# Altium schematic sheet ATmega324PB_Xplained_Pro_EDBG.SchDoc: Embedded Debugger (EDBG)
size A3; Organization: ATMEL Norway; Address1: Vestre Rosten 79; Address2: N-7075 TILLER; Address3: NORWAY; DocumentNumber: A09-2589; Revision: 1; SheetNumber: 5; SheetTotal: 5; PageSetup: Record=PageOptions|CenterHorizontal=True|CenterVertical=True|PrintScale=0.73|XCorrection=1.00|YCorrection=1.00|PrintKind=1|BorderSize=5000000|LeftOffset=0|BottomOffset=0|Orientation=2|PaperLength=1000|PaperWidth=1000|Scale=100|PaperSource=7|PrintQuality=-4|MediaType=1|DitherType=10|PaperKind=A3 (297 x 420 mm)|PrintScaleMode=1
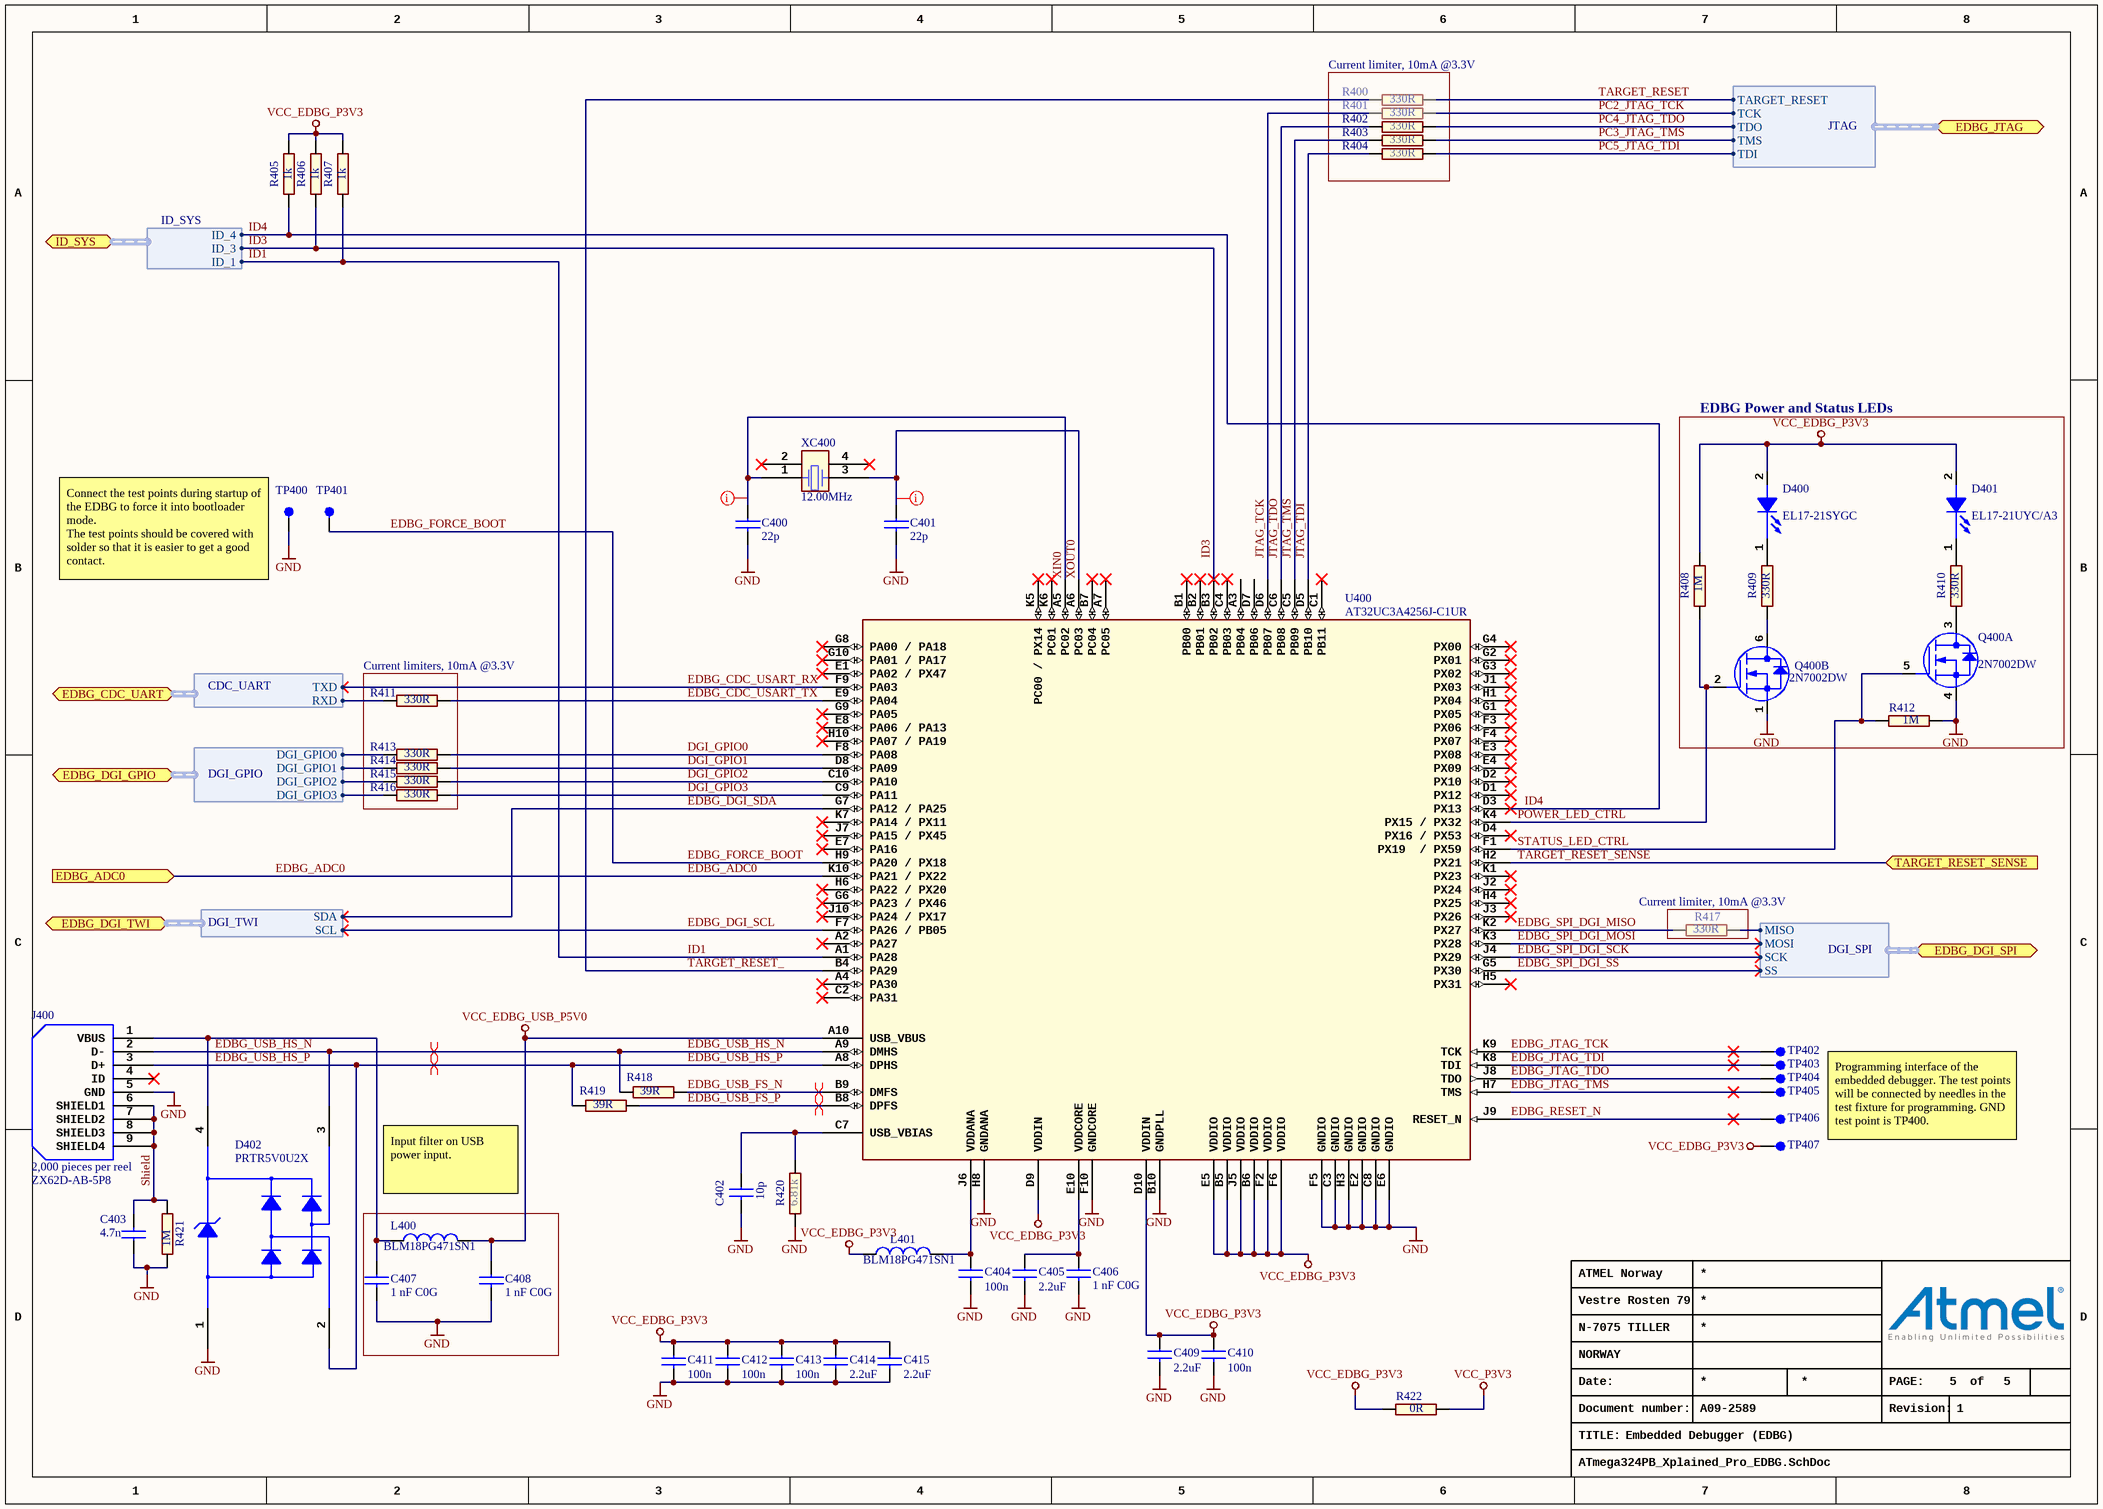
[diagram p0: ATmega324PB_Xplained_Pro_EDBG.SchDoc]

## Parts
C400  value 22p  [AP1-00053]
C401  value 22p  [AP1-00053]
C402  value 10p  [AP1-00053]
C403  value 4.7n  [AP1-00053]
C404  value 100n  [AP1-00053]
C405  value 2.2uF  [AP1-00053]  (hidden comment: Farnell no: 1288200)
C406  value 1 nF C0G  [AP1-00053]
C407  value 1 nF C0G  [AP1-00053]
C408  value 1 nF C0G  [AP1-00053]
C409  value 2.2uF  [AP1-00053]  (hidden comment: Farnell no: 1288200)
C410  value 100n  [AP1-00053]
C411  value 100n  [AP1-00053]
C412  value 100n  [AP1-00053]
C413  value 100n  [AP1-00053]
C414  value 2.2uF  [AP1-00053]  (hidden comment: Farnell no: 1288200)
C415  value 2.2uF  [AP1-00053]  (hidden comment: Farnell no: 1288200)
D400  value EL17-21SYGC  [AP4-00013]
D401  value EL17-21UYC/A3  [AP4-00013]
D402  value PRTR5V0U2X  [AP4-00001]  (hidden comment: Changed manufacturer from Philips to NXP.)
J400  2,000 pieces per reel  value ZX62D-AB-5P8  [AP8-00852]
L400  value BLM18PG471SN1  [AP3-00005]
L401  value BLM18PG471SN1  [AP3-00005]
Q400  value 2N7002DW  [AP5-00001]  (hidden comment: Same as 2N7002 but with two MOSFETs in one package)  (parts A,B of 2)
R400  value 330R  [AP2-00000]
R401  value 330R  [AP2-00000]
R402  value 330R  [AP2-00000]
R403  value 330R  [AP2-00000]
R404  value 330R  [AP2-00000]
R405  value 1k  [AP2-00000]
R406  value 1k  [AP2-00000]
R407  value 1k  [AP2-00000]
R408  value 1M  [AP2-00000]
R409  value 330R  [AP2-00000]
R410  value 330R  [AP2-00000]
R411  value 330R  [AP2-00000]
R412  value 1M  [AP2-00000]
R413  value 330R  [AP2-00000]
R414  value 330R  [AP2-00000]
R415  value 330R  [AP2-00000]
R416  value 330R  [AP2-00000]
R417  value 330R  [AP2-00000]
R418  value 39R  [AP2-00011]
R419  value 39R  [AP2-00011]
R420  value 6.81k  [AP2-00011]
R421  value 1M  [AP2-00011]
R422  value 0R  [AP2-00000]
TP400  (no value)  [AP8-00010]  (no BOM)
TP401  (no value)  [AP8-00010]  (no BOM)
TP402  (no value)  [AP8-00010]  (no BOM)
TP403  (no value)  [AP8-00010]  (no BOM)
TP404  (no value)  [AP8-00010]  (no BOM)
TP405  (no value)  [AP8-00010]  (no BOM)
TP406  (no value)  [AP8-00010]  (no BOM)
TP407  (no value)  [AP8-00010]  (no BOM)
U400  value AT32UC3A4256J-C1UR  [AP6-00206]  (hidden comment: 100 ball VFBGA)
XC400  value 12.00MHz  [AP7-00039]

## Blocks framed on the sheet
Current limiter, 10mA @3.3V: R400-R404
EDBG Power and Status LEDs: D400 D401 Q400 R408-R410 R412
Current limiters, 10mA @3.3V: R411 R413-R416

## Ports
EDBG_ADC0 (in), EDBG_CDC_UART (harness CDC_UART), EDBG_DGI_GPIO (harness DGI_GPIO), EDBG_DGI_SPI (harness DGI_SPI), EDBG_DGI_TWI (harness DGI_TWI), EDBG_JTAG (harness JTAG), ID_SYS (harness ID_SYS), TARGET_RESET_SENSE (in)

## Harnesses
CDC_UART: TXD, RXD
DGI_SPI: MISO, MOSI, SCK, SS
DGI_GPIO: DGI_GPIO0, DGI_GPIO1, DGI_GPIO2, DGI_GPIO3
DGI_TWI: SCL, SDA
JTAG: TCK, TDI, TDO, TMS, TARGET_RESET
ID_SYS: ID_1, ID_3, ID_4

## Nets
GND: C400.2 C401.2 C402.2 C403.1 C404.2 C405.2 C406.2 C407.2 C408.2 C409.2 C410.2 C411.2 C412.2 C413.2 C414.2 C415.2 D402.1(GND) J400.5(GND) Q400.1(S2) Q400.4(S1) R412.1 R420.1 R421.1 TP400.1 U400.B10(GNDPLL) U400.C3(GNDIO) U400.C8(GNDIO) U400.E2(GNDIO) U400.E6(GNDIO) U400.F5(GNDIO) U400.F10(GNDCORE) U400.H3(GNDIO) U400.H8(GNDANA)
VCC_EDBG_P3V3: C409.1 C410.1 C411.1 C412.1 C413.1 C414.1 C415.1 D400.2(ANODE) D401.2(ANODE) L401.1 R405.2 R406.2 R407.2 R408.2 R422.1 TP407.1 U400.B5(VDDIO) U400.B6(VDDIO) U400.D9(VDDIN) U400.D10(VDDIN) U400.E5(VDDIO) U400.F2(VDDIO) U400.F6(VDDIO) U400.J5(VDDIO)
VCC_EDBG_USB_P5V0: C408.1 L400.2 U400.A10(USB_VBUS)
VCC_P3V3: R422.2
DGI_GPIO0: R413.2 U400.F8(PA08)
DGI_GPIO1: R414.2 U400.D8(PA09)
DGI_GPIO2: R415.2 U400.C10(PA10)
DGI_GPIO3: R416.2 U400.C9(PA11)
EDBG_ADC0: U400.K10(PA21_/_PX22) ; port EDBG_ADC0
EDBG_CDC_USART_RX: U400.F9(PA03) ; port EDBG_CDC_UART.TXD
EDBG_CDC_USART_TX: R411.2 U400.E9(PA04)
EDBG_DGI_SCL: U400.F7(PA26_/_PB05) ; port EDBG_DGI_TWI.SCL
EDBG_DGI_SDA: U400.G7(PA12_/_PA25) ; port EDBG_DGI_TWI.SDA
EDBG_FORCE_BOOT: TP401.1 U400.H9(PA20_/_PX18)
EDBG_JTAG_TCK: TP402.1 U400.K9(TCK)
EDBG_JTAG_TDI: TP403.1 U400.K8(TDI)
EDBG_JTAG_TDO: TP404.1 U400.J8(TDO)
EDBG_JTAG_TMS: TP405.1 U400.H7(TMS)
EDBG_RESET_N: TP406.1 U400.J9(RESET_N)
EDBG_SPI_DGI_MISO: R417.1 U400.K2(PX27)
EDBG_SPI_DGI_MOSI: U400.K3(PX28) ; port EDBG_DGI_SPI.MOSI
EDBG_SPI_DGI_SCK: U400.J4(PX29) ; port EDBG_DGI_SPI.SCK
EDBG_SPI_DGI_SS: U400.G5(PX30) ; port EDBG_DGI_SPI.SS
EDBG_USB_FS_N: R418.2 U400.B9(DMFS)
EDBG_USB_FS_P: R419.2 U400.B8(DPFS)
EDBG_USB_HS_N: D402.3(I/O_2) J400.2(D-) R418.1 U400.A9(DMHS)
EDBG_USB_HS_P: D402.2(I/O_1) J400.3(D+) R419.1 U400.A8(DPHS)
ID1: R407.1 U400.A1(PA28) ; port ID_SYS.ID_1
ID3: R406.1 U400.B3(PB02) ; port ID_SYS.ID_3
ID4: R405.1 U400.D3(PX13) ; port ID_SYS.ID_4
JTAG_TCK: R401.1 U400.D6(PB07)
JTAG_TDI: R404.1 U400.D5(PB10)
JTAG_TDO: R402.1 U400.C6(PB08)
JTAG_TMS: R403.1 U400.C5(PB09)
PC2_JTAG_TCK: R401.2 ; port EDBG_JTAG.TCK
PC3_JTAG_TMS: R403.2 ; port EDBG_JTAG.TMS
PC4_JTAG_TDO: R402.2 ; port EDBG_JTAG.TDO
PC5_JTAG_TDI: R404.2 ; port EDBG_JTAG.TDI
POWER_LED_CTRL: Q400.2(G2) R408.1 U400.K4(PX15_/_PX32)
Shield: C403.2 J400.6(SHIELD1) J400.7(SHIELD2) J400.8(SHIELD3) J400.9(SHIELD4) R421.2
STATUS_LED_CTRL: Q400.5(G1) R412.2 U400.F1(PX19__/_PX59)
TARGET_RESET: R400.2 ; port EDBG_JTAG.TARGET_RESET
TARGET_RESET_: R400.1 U400.B4(PA29)
TARGET_RESET_SENSE: U400.H2(PX21) ; port TARGET_RESET_SENSE
XIN0: C400.1 U400.A5(PC02) XC400.1
XOUT0: C401.1 U400.A6(PC03) XC400.3
NetC402_1: C402.1 R420.2 U400.C7(USB_VBIAS)
NetC404_1: C404.1 L401.2 U400.J6(VDDANA)
NetC405_1: C405.1 C406.1 U400.E10(VDDCORE)
NetC407_1: C407.1 D402.4(VCC) J400.1(VBUS) L400.1
NetD400_1: D400.1(CATHODE) R409.2
NetD401_1: D401.1(CATHODE) R410.2
NetQ400_3: Q400.3(D1) R410.1
NetQ400_6: Q400.6(D2) R409.1
NetR411_1: R411.1 ; port EDBG_CDC_UART.RXD
NetR413_1: R413.1 ; port EDBG_DGI_GPIO.DGI_GPIO0
NetR414_1: R414.1 ; port EDBG_DGI_GPIO.DGI_GPIO1
NetR415_1: R415.1 ; port EDBG_DGI_GPIO.DGI_GPIO2
NetR416_1: R416.1 ; port EDBG_DGI_GPIO.DGI_GPIO3
NetR417_2: R417.2 ; port EDBG_DGI_SPI.MISO

Not connected (* = marked no-connect by the designer): J400 4(ID)*; U400 A2(PA27)* A3(PB04) A4(PA30)* A7(PC05)* B1(PB00)* B2(PB01)* B7(PC04)* C1(PB11)* C2(PA31)* C4(PB03)* D1(PX12)* D2(PX10)* D4(PX16_/_PX53)* D7(PB06) E1(PA02_/_PX47)* E3(PX08)* E4(PX09)* E7(PA16)* E8(PA06_/_PA13)* F3(PX06)* F4(PX07)* G1(PX05)* G2(PX01)* G3(PX02)* G4(PX00)* G6(PA23_/_PX46)* G8(PA00_/_PA18)* G9(PA05)* G10(PA01_/_PA17)* H1(PX04)* H4(PX25)* H5(PX31)* H6(PA22_/_PX20)* H10(PA07_/_PA19)* J1(PX03)* J2(PX24)* J3(PX26)* J7(PA15_/_PX45)* J10(PA24_/_PX17)* K1(PX23)* K5(PC00_/_PX14)* K6(PC01)* K7(PA14_/_PX11)*; XC400 2* 4*

## Layout directives
differential pair; rule Assembly Testpoint Usage [Testpoint - Not Allowed    Multiple - Not Allowed]: EDBG_USB_FS_N, EDBG_USB_FS_P, EDBG_USB_HS_N, EDBG_USB_HS_P
rule Assembly Testpoint Usage [Testpoint - Not Allowed    Multiple - Not Allowed]: XIN0, XOUT0

## Notes on the sheet
- (near TP400) Connect the test points during startup of the EDBG to force it into bootloader mode.
  The test points should be covered with solder so that it is easier to get a good contact.
- (near R417) Current limiter, 10mA @3.3V
- Input filter on USB power input.
- Programming interface of the embedded debugger. The test points will be connected by needles in the test fixture for programming. GND test point is TP400.
- Date:
- PAGE:
- of
- TITLE:
- Document number:
- Revision:

## Library data of the parts
C400 C401 = A01-0019: Ceramic capacitor, SMD 0402, NP0, 50V, +/-5%; PartGroup: Capacitors,Ceramic,SMD 0402; TemperatureRange: -55 - +125 deg C; AN: A01-0019; Tolerance: 50V, +/-5%; Height: 0,550000011920929
C402 = A01-0015: Ceramic capacitor, SMD 0402, NP0, 50V, +/-5%; PartGroup: Capacitors,Ceramic,SMD 0402; TemperatureRange: -55 - +125 deg C; AN: A01-0015; Tolerance: 50V, +/-5%; Height: 0,550000011920929
C403 = A01-0046: Ceramic capacitor, SMD 0402, X7R, 25V, +/-10%; PartGroup: Capacitors,Ceramic,SMD 0402; TemperatureRange: -55 - +125 deg C; AN: A01-0046; Tolerance: 25V, +/-10%; Height: 0,550000011920929
C404 C410-C413 = A01-0246: Ceramic capacitor, SMD 0402, X7R, 16V, +/-10%; PartGroup: Capacitors,Ceramic,SMD 0402; Manufacturer: Kemet; MPN: C0402C104K4RACTU; TemperatureRange: -55 - +125 deg C; AN: A01-0246; Tolerance: 16V, +/-10%; Height: 0,5
C405 C409 C414 C415 = A01-0300: Ceramic capacitor, SMD 0402, X5R, 6.3V, +/-20%; PartGroup: Capacitors,Ceramic,SMD 0402; Manufacturer: Kemet; MPN: C0402C225M9PAC; Tolerance: Â±20%; TemperatureRange: -55Â°C to +85Â°C; AN: A01-0300; Height: 0,5
C406-C408 = A01-0321: Ceramic capacitor, SMD 0402, C0G, 50V, +/-5%; PartGroup: Capacitors,Ceramic,SMD 0402; Manufacturer: Murata; MPN: GRM1555C1H102JA01D; Tolerance: 5%; AN: A01-0321; Height: 0,550000011920929
D400 = A10-0018: LED, Green, Wave length=575nm, SMD 0805, ±70°; PartGroup: Opto,LEDs,SMD; Manufacturer: Everlight; TemperatureRange: -40 - +85 deg C; AN: A10-0018; Height: 1,10000002384186; MPN: EL17-21SYGC
D401 = A10-0019: LED, Yellow, Wave length=591nm, SMD 0805, ±70°; PartGroup: Opto,LEDs,SMD; Manufacturer: Everlight; MPN: 17-21UYC/S530-A3/TR8; TemperatureRange: -40 to +85 deg C; AN: A10-0019; Height: 1,10000002384186
D402 = A06-0236: Double rail-to-rail USB ESD protection diode; OrcadPartType: Integrated Circuits&Special function&Protection; Manufacturer: NXP; PartGroup: Integrated Circuits,Special function,Protection; TemperatureRange: -40 to +85 C; AN: A06-0236; PartType: Buy; Height: 1,10000002384186; MPN: PRTR5V0U2X
J400 = A08-2112: Micro USB AB Connector, Standard SMT + DIP; PartGroup: Mechanical devices,Connectors,USB; Manufacturer: HIROSE; AN: A08-2112; Height: 2,79999995231628; MPN: ZX62D-AB-5P8
L400 L401 = A03-0035: SMD RF inductor 0603. Z=470Ohm (@100MHz), Max R(dc)=0.65Ohm, Max current=1A; PartGroup: Inductors,EMI; Manufacturer: Murata; Tolerance: ±25%; TemperatureRange: -55°C to +125°C; AN: A03-0035; Height: 0,800000011920929; MPN: BLM18PG471SN1
Q400 = A05-0051: Dual N-Channel MOSFET, 60V, 115mA cont,RDS(ON) < 7.5 Ohm @50mA@5V, SOT-363; PartGroup: Transistors,Small signal FET,SMD; Manufacturer: Fairchild; TemperatureRange: -65 to 150 deg C; AN: A05-0051; Height: 1,10000002384186; MPN: 2N7002DW
R400-R404 R409-R411 R413-R417 = A02-0200: Thick film resistor, SMD 0402, 1/16W, 1%; PartGroup: Resistors,SMD,0402 1%; TemperatureRange: -55 - +125 deg C; AN: A02-0200; Tolerance: 1 %; Height: 0,349999994039536
R405-R407 = A02-0212: Thick film resistor, SMD 0402, 1/16W, 1%; PartGroup: Resistors,SMD,0402 1%; TemperatureRange: -55 - +125 deg C; AN: A02-0212; Tolerance: 1 %; Height: 0,349999994039536
R408 R412 R421 = A02-0284: Thick film resistor, SMD 0402, 1/16W, 1%; PartGroup: Resistors,SMD,0402 1%; TemperatureRange: -55 - +125 deg C; AN: A02-0284; Tolerance: 1 %; Height: 0,349999994039536
R418 R419 = A02-0178: Thick film resistor, SMD 0402, 1/16W, 1%; PartGroup: Resistors,SMD,0402 1%; TemperatureRange: -55 - +125 deg C; AN: A02-0178; Tolerance: 1 %; Height: 0,349999994039536
R420 = A02-0539: Thick film resistor, SMD 0402, 1/16W, 1%; PartGroup: Resistors,SMD,0402 1%; TemperatureRange: -55 - +125 deg C; AN: A02-0539; Tolerance: 1%; Height: 0,349999994039536
R422 = A02-0163: Thick film resistor, SMD 0402, 1/16W, 1%; PartGroup: Resistors,SMD,0402 1%; Manufacturer: (n/a); MPN: RMCF0402ZT0R00; TemperatureRange: -55 - +125 deg C; AN: A02-0163; Tolerance: 1 %; Height: 0,349999994039536
TP400-TP407 = A08-0004: Single SMD testpad; PartGroup: Mechanical devices,Connectors,Test points; AN: A08-0004; Value: TESTPAD; Height: 0
U400 = A06-0736: AVR 32-bit RISC MCU; PartGroup: Integrated Circuits,MCU, MPU, DSP,AVR MCU; Manufacturer: ATMEL; TemperatureRange: -40 to +85 deg C; AN: A06-0736; Height: 1; MPN: AT32UC3A4256J-C1UR
XC400 = A07-0042: Fox FQ5032B 12.0MHz SMD crystal 738B-12; PartGroup: Frequency devices,Crystals,SMD; Manufacturer: Fox  Electronics; MPN: FQ5032B-12.000; Tolerance: Â±30ppm; TemperatureRange: 0Â°C ~ 70Â°C; AN: A07-0042; Height: 1,20000004768372